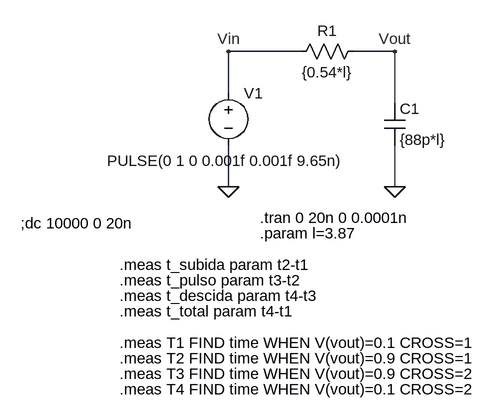
[diagram p0: schematic Draft1.asc]
Draft1.asc, the LTspice schematic file:
Version 4
SHEET 1 980 680
WIRE -32 64 -144 64
WIRE 112 64 48 64
WIRE -144 128 -144 64
WIRE 112 144 112 64
WIRE -144 272 -144 208
WIRE 112 272 112 208
FLAG -144 272 0
FLAG 112 272 0
FLAG 112 64 Vout
FLAG -144 64 Vin
SYMBOL cap 96 144 R0
SYMATTR InstName C1
SYMATTR Value {88p*l}
SYMBOL res 64 48 R90
WINDOW 0 0 56 VBottom 2
WINDOW 3 32 56 VTop 2
SYMATTR InstName R1
SYMATTR Value {0.54*l}
SYMBOL voltage -144 112 R0
WINDOW 3 -187 120 Left 2
WINDOW 123 0 0 Left 0
WINDOW 39 0 0 Left 0
SYMATTR Value PULSE(0 1 0 0.001f 0.001f 9.65n)
SYMATTR InstName V1
TEXT -96 344 Left 2 !.param l=3.87
TEXT -96 320 Left 2 !.tran 0 20n 0 0.0001n
TEXT -312 512 Left 2 !.meas T1 FIND time WHEN V(vout)=0.1 CROSS=1
TEXT -312 536 Left 2 !.meas T2 FIND time WHEN V(vout)=0.9 CROSS=1
TEXT -312 560 Left 2 !.meas T3 FIND time WHEN V(vout)=0.9 CROSS=2
TEXT -312 584 Left 2 !.meas T4 FIND time WHEN V(vout)=0.1 CROSS=2
TEXT -312 392 Left 2 !.meas t_subida param t2-t1
TEXT -312 416 Left 2 !.meas t_pulso param t3-t2
TEXT -312 440 Left 2 !.meas t_descida param t4-t3
TEXT -312 464 Left 2 !.meas t_total param t4-t1
TEXT -464 328 Left 2 !;dc 10000 0 20n

The netlist it stands for:
* Draft1.asc
C1 Vout 0 {88p*l}
R1 Vout Vin {0.54*l}
V1 Vin 0 PULSE(0 1 0 0.001f 0.001f 9.65n)
.param l=3.87
.tran 0 20n 0 0.0001n
.meas T1 FIND time WHEN V(vout)=0.1 CROSS=1
.meas T2 FIND time WHEN V(vout)=0.9 CROSS=1
.meas T3 FIND time WHEN V(vout)=0.9 CROSS=2
.meas T4 FIND time WHEN V(vout)=0.1 CROSS=2
.meas t_subida param t2-t1
.meas t_pulso param t3-t2
.meas t_descida param t4-t3
.meas t_total param t4-t1
;dc 10000 0 20n
.backanno
.end